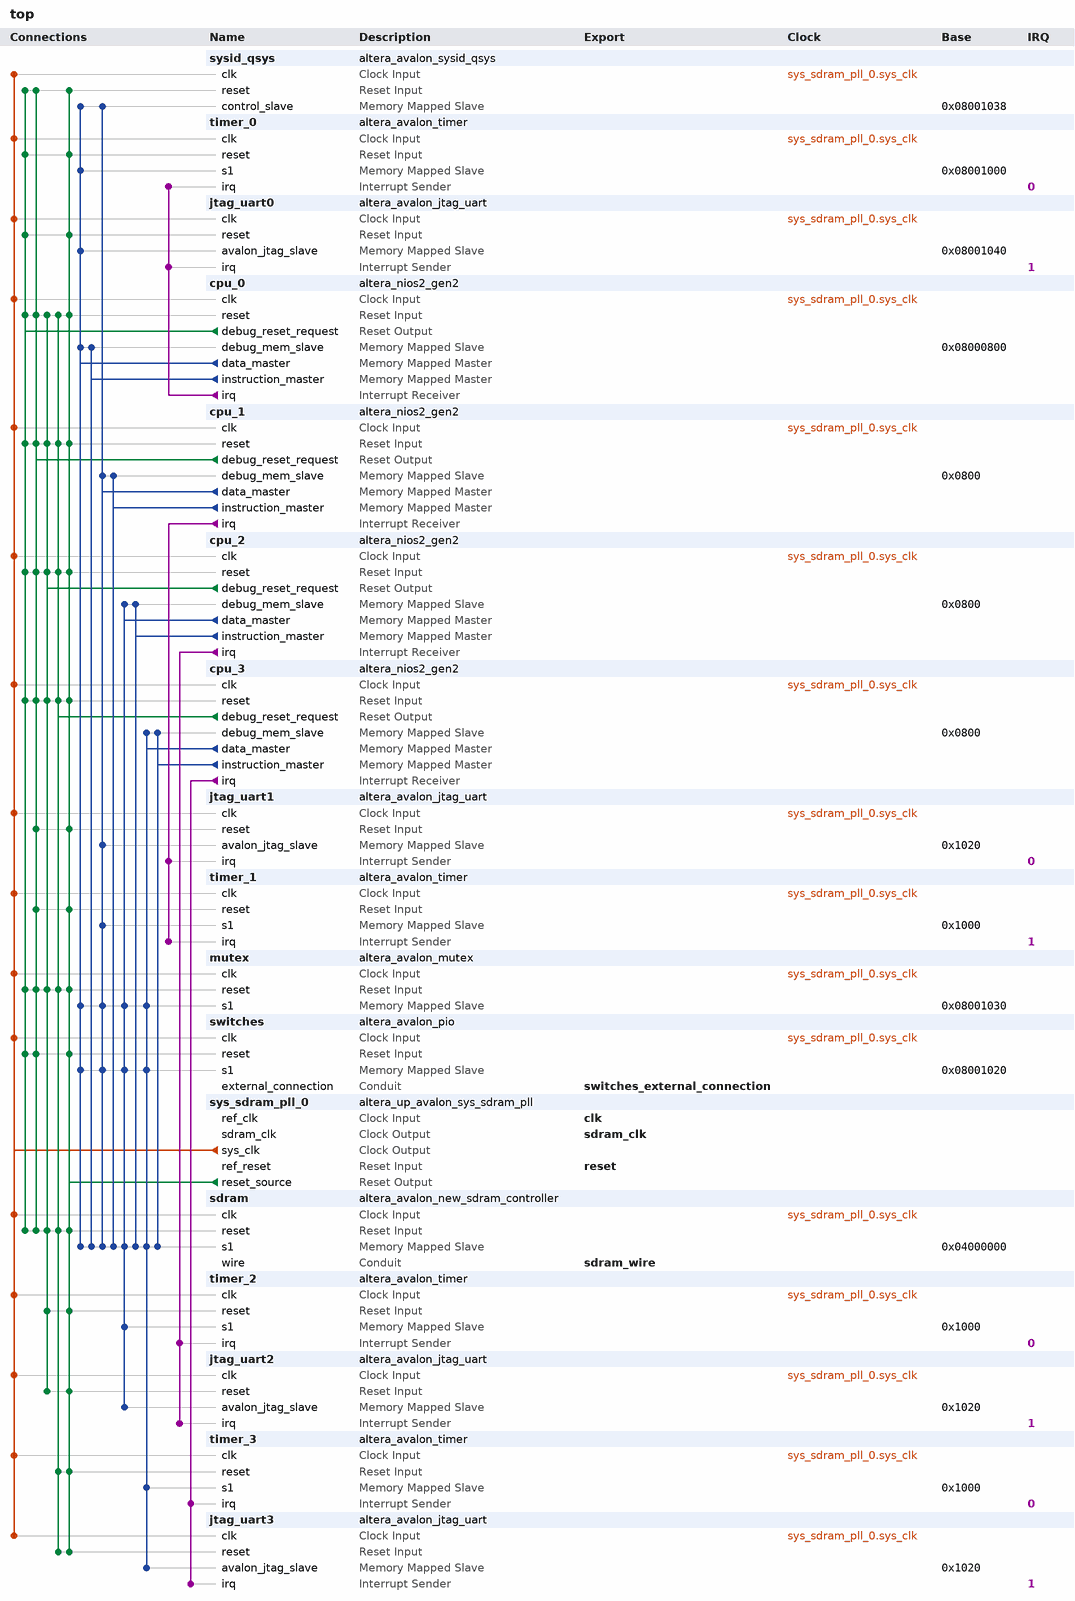
[diagram p0: system contents]
# Platform Designer (Qsys) system top, Cyclone IV E EP4CE115F29C7
# Parameters at their usual value, and those the tool derives, are not listed.
package require -exact qsys 18.1
create_system top
set_project_property DEVICE_FAMILY {Cyclone IV E}
set_project_property DEVICE EP4CE115F29C7

add_instance sysid_qsys altera_avalon_sysid_qsys 18.1
set_instance_parameter_value sysid_qsys id 0

add_instance timer_0 altera_avalon_timer 18.1
set_instance_parameter_value timer_0 period 10
set_instance_parameter_value timer_0 periodUnits MSEC

add_instance jtag_uart0 altera_avalon_jtag_uart 18.1
set_instance_parameter_value jtag_uart0 simInteractiveOptions NO_INTERACTIVE_WINDOWS

add_instance cpu_0 altera_nios2_gen2 18.1
set_instance_parameter_value cpu_0 cpuID 1
set_instance_parameter_value cpu_0 dcache_size 32768
set_instance_parameter_value cpu_0 exceptionSlave sdram.s1
set_instance_parameter_value cpu_0 icache_size 32768
set_instance_parameter_value cpu_0 impl Fast
set_instance_parameter_value cpu_0 resetSlave sdram.s1
set_instance_parameter_value cpu_0 setting_activateTrace true

add_instance cpu_1 altera_nios2_gen2 18.1
set_instance_parameter_value cpu_1 cpuID 2
set_instance_parameter_value cpu_1 dcache_size 2048
set_instance_parameter_value cpu_1 exceptionOffset 16777248
set_instance_parameter_value cpu_1 exceptionSlave sdram.s1
set_instance_parameter_value cpu_1 icache_size 4096
set_instance_parameter_value cpu_1 impl Fast
set_instance_parameter_value cpu_1 resetOffset 16777216
set_instance_parameter_value cpu_1 resetSlave sdram.s1

add_instance cpu_2 altera_nios2_gen2 18.1
set_instance_parameter_value cpu_2 cpuID 3
set_instance_parameter_value cpu_2 dcache_size 2048
set_instance_parameter_value cpu_2 exceptionOffset 33554464
set_instance_parameter_value cpu_2 exceptionSlave sdram.s1
set_instance_parameter_value cpu_2 icache_size 4096
set_instance_parameter_value cpu_2 impl Fast
set_instance_parameter_value cpu_2 resetOffset 33554432
set_instance_parameter_value cpu_2 resetSlave sdram.s1

add_instance cpu_3 altera_nios2_gen2 18.1
set_instance_parameter_value cpu_3 cpuID 4
set_instance_parameter_value cpu_3 dcache_size 2048
set_instance_parameter_value cpu_3 exceptionOffset 50331680
set_instance_parameter_value cpu_3 exceptionSlave sdram.s1
set_instance_parameter_value cpu_3 icache_size 4096
set_instance_parameter_value cpu_3 impl Fast
set_instance_parameter_value cpu_3 resetOffset 50331648
set_instance_parameter_value cpu_3 resetSlave sdram.s1

add_instance jtag_uart1 altera_avalon_jtag_uart 18.1
set_instance_parameter_value jtag_uart1 simInteractiveOptions NO_INTERACTIVE_WINDOWS

add_instance timer_1 altera_avalon_timer 18.1
set_instance_parameter_value timer_1 period 10
set_instance_parameter_value timer_1 periodUnits MSEC

add_instance mutex altera_avalon_mutex 18.1

add_instance switches altera_avalon_pio 18.1
set_instance_parameter_value switches direction Input
set_instance_parameter_value switches width 8

add_instance sys_sdram_pll_0 altera_up_avalon_sys_sdram_pll 18.0
set_instance_parameter_value sys_sdram_pll_0 CV_boards DE10-Standard
set_instance_parameter_value sys_sdram_pll_0 gui_outclk 50.0
set_instance_parameter_value sys_sdram_pll_0 gui_refclk 50.0

add_instance sdram altera_avalon_new_sdram_controller 18.1
set_instance_parameter_value sdram TAC 5.5
set_instance_parameter_value sdram TRCD 20.0
set_instance_parameter_value sdram TRP 20.0
set_instance_parameter_value sdram casLatency 3
set_instance_parameter_value sdram columnWidth 9
set_instance_parameter_value sdram dataWidth 32
set_instance_parameter_value sdram generateSimulationModel false
set_instance_parameter_value sdram model single_Micron_MT48LC4M32B2_7_chip
set_instance_parameter_value sdram numberOfBanks 4
set_instance_parameter_value sdram numberOfChipSelects 1
set_instance_parameter_value sdram powerUpDelay 100.0
set_instance_parameter_value sdram refreshPeriod 15.625
set_instance_parameter_value sdram rowWidth 13

add_instance timer_2 altera_avalon_timer 18.1
set_instance_parameter_value timer_2 period 10
set_instance_parameter_value timer_2 periodUnits MSEC

add_instance jtag_uart2 altera_avalon_jtag_uart 18.1
set_instance_parameter_value jtag_uart2 simInteractiveOptions NO_INTERACTIVE_WINDOWS

add_instance timer_3 altera_avalon_timer 18.1
set_instance_parameter_value timer_3 period 10
set_instance_parameter_value timer_3 periodUnits MSEC

add_instance jtag_uart3 altera_avalon_jtag_uart 18.1
set_instance_parameter_value jtag_uart3 simInteractiveOptions NO_INTERACTIVE_WINDOWS

# connections
add_connection sys_sdram_pll_0.sys_clk cpu_0.clk clock
add_connection sys_sdram_pll_0.sys_clk cpu_1.clk clock
add_connection sys_sdram_pll_0.sys_clk cpu_2.clk clock
add_connection sys_sdram_pll_0.sys_clk cpu_3.clk clock
add_connection sys_sdram_pll_0.sys_clk jtag_uart0.clk clock
add_connection sys_sdram_pll_0.sys_clk jtag_uart1.clk clock
add_connection sys_sdram_pll_0.sys_clk jtag_uart2.clk clock
add_connection sys_sdram_pll_0.sys_clk jtag_uart3.clk clock
add_connection sys_sdram_pll_0.sys_clk mutex.clk clock
add_connection sys_sdram_pll_0.sys_clk sdram.clk clock
add_connection sys_sdram_pll_0.sys_clk switches.clk clock
add_connection sys_sdram_pll_0.sys_clk sysid_qsys.clk clock
add_connection sys_sdram_pll_0.sys_clk timer_0.clk clock
add_connection sys_sdram_pll_0.sys_clk timer_1.clk clock
add_connection sys_sdram_pll_0.sys_clk timer_2.clk clock
add_connection sys_sdram_pll_0.sys_clk timer_3.clk clock
add_connection cpu_0.debug_reset_request cpu_0.reset reset
add_connection cpu_0.debug_reset_request cpu_1.reset reset
add_connection cpu_0.debug_reset_request cpu_2.reset reset
add_connection cpu_0.debug_reset_request cpu_3.reset reset
add_connection cpu_0.debug_reset_request jtag_uart0.reset reset
add_connection cpu_0.debug_reset_request mutex.reset reset
add_connection cpu_0.debug_reset_request sdram.reset reset
add_connection cpu_0.debug_reset_request switches.reset reset
add_connection cpu_0.debug_reset_request sysid_qsys.reset reset
add_connection cpu_0.debug_reset_request timer_0.reset reset
add_connection cpu_1.debug_reset_request cpu_0.reset reset
add_connection cpu_1.debug_reset_request cpu_1.reset reset
add_connection cpu_1.debug_reset_request cpu_2.reset reset
add_connection cpu_1.debug_reset_request cpu_3.reset reset
add_connection cpu_1.debug_reset_request jtag_uart1.reset reset
add_connection cpu_1.debug_reset_request mutex.reset reset
add_connection cpu_1.debug_reset_request sdram.reset reset
add_connection cpu_1.debug_reset_request switches.reset reset
add_connection cpu_1.debug_reset_request sysid_qsys.reset reset
add_connection cpu_1.debug_reset_request timer_1.reset reset
add_connection cpu_2.debug_reset_request cpu_0.reset reset
add_connection cpu_2.debug_reset_request cpu_1.reset reset
add_connection cpu_2.debug_reset_request cpu_2.reset reset
add_connection cpu_2.debug_reset_request cpu_3.reset reset
add_connection cpu_2.debug_reset_request jtag_uart2.reset reset
add_connection cpu_2.debug_reset_request mutex.reset reset
add_connection cpu_2.debug_reset_request sdram.reset reset
add_connection cpu_2.debug_reset_request timer_2.reset reset
add_connection cpu_3.debug_reset_request cpu_0.reset reset
add_connection cpu_3.debug_reset_request cpu_1.reset reset
add_connection cpu_3.debug_reset_request cpu_2.reset reset
add_connection cpu_3.debug_reset_request cpu_3.reset reset
add_connection cpu_3.debug_reset_request jtag_uart3.reset reset
add_connection cpu_3.debug_reset_request mutex.reset reset
add_connection cpu_3.debug_reset_request sdram.reset reset
add_connection cpu_3.debug_reset_request timer_3.reset reset
add_connection sys_sdram_pll_0.reset_source cpu_0.reset reset
add_connection sys_sdram_pll_0.reset_source cpu_1.reset reset
add_connection sys_sdram_pll_0.reset_source cpu_2.reset reset
add_connection sys_sdram_pll_0.reset_source cpu_3.reset reset
add_connection sys_sdram_pll_0.reset_source jtag_uart0.reset reset
add_connection sys_sdram_pll_0.reset_source jtag_uart1.reset reset
add_connection sys_sdram_pll_0.reset_source jtag_uart2.reset reset
add_connection sys_sdram_pll_0.reset_source jtag_uart3.reset reset
add_connection sys_sdram_pll_0.reset_source mutex.reset reset
add_connection sys_sdram_pll_0.reset_source sdram.reset reset
add_connection sys_sdram_pll_0.reset_source switches.reset reset
add_connection sys_sdram_pll_0.reset_source sysid_qsys.reset reset
add_connection sys_sdram_pll_0.reset_source timer_0.reset reset
add_connection sys_sdram_pll_0.reset_source timer_1.reset reset
add_connection sys_sdram_pll_0.reset_source timer_2.reset reset
add_connection sys_sdram_pll_0.reset_source timer_3.reset reset
add_connection cpu_0.data_master cpu_0.debug_mem_slave avalon
set_connection_parameter_value cpu_0.data_master/cpu_0.debug_mem_slave baseAddress 0x08000800
add_connection cpu_0.data_master jtag_uart0.avalon_jtag_slave avalon
set_connection_parameter_value cpu_0.data_master/jtag_uart0.avalon_jtag_slave baseAddress 0x08001040
add_connection cpu_0.data_master mutex.s1 avalon
set_connection_parameter_value cpu_0.data_master/mutex.s1 baseAddress 0x08001030
add_connection cpu_0.data_master sdram.s1 avalon
set_connection_parameter_value cpu_0.data_master/sdram.s1 baseAddress 0x04000000
add_connection cpu_0.data_master switches.s1 avalon
set_connection_parameter_value cpu_0.data_master/switches.s1 baseAddress 0x08001020
add_connection cpu_0.data_master sysid_qsys.control_slave avalon
set_connection_parameter_value cpu_0.data_master/sysid_qsys.control_slave baseAddress 0x08001038
add_connection cpu_0.data_master timer_0.s1 avalon
set_connection_parameter_value cpu_0.data_master/timer_0.s1 baseAddress 0x08001000
add_connection cpu_0.instruction_master cpu_0.debug_mem_slave avalon
set_connection_parameter_value cpu_0.instruction_master/cpu_0.debug_mem_slave baseAddress 0x08000800
add_connection cpu_0.instruction_master sdram.s1 avalon
set_connection_parameter_value cpu_0.instruction_master/sdram.s1 baseAddress 0x04000000
add_connection cpu_1.data_master cpu_1.debug_mem_slave avalon
set_connection_parameter_value cpu_1.data_master/cpu_1.debug_mem_slave baseAddress 0x0800
add_connection cpu_1.data_master jtag_uart1.avalon_jtag_slave avalon
set_connection_parameter_value cpu_1.data_master/jtag_uart1.avalon_jtag_slave baseAddress 0x1020
add_connection cpu_1.data_master mutex.s1 avalon
set_connection_parameter_value cpu_1.data_master/mutex.s1 baseAddress 0x08001030
add_connection cpu_1.data_master sdram.s1 avalon
set_connection_parameter_value cpu_1.data_master/sdram.s1 baseAddress 0x04000000
add_connection cpu_1.data_master switches.s1 avalon
set_connection_parameter_value cpu_1.data_master/switches.s1 baseAddress 0x08001020
add_connection cpu_1.data_master sysid_qsys.control_slave avalon
set_connection_parameter_value cpu_1.data_master/sysid_qsys.control_slave baseAddress 0x08001038
add_connection cpu_1.data_master timer_1.s1 avalon
set_connection_parameter_value cpu_1.data_master/timer_1.s1 baseAddress 0x1000
add_connection cpu_1.instruction_master cpu_1.debug_mem_slave avalon
set_connection_parameter_value cpu_1.instruction_master/cpu_1.debug_mem_slave baseAddress 0x0800
add_connection cpu_1.instruction_master sdram.s1 avalon
set_connection_parameter_value cpu_1.instruction_master/sdram.s1 baseAddress 0x04000000
add_connection cpu_2.data_master cpu_2.debug_mem_slave avalon
set_connection_parameter_value cpu_2.data_master/cpu_2.debug_mem_slave baseAddress 0x0800
add_connection cpu_2.data_master jtag_uart2.avalon_jtag_slave avalon
set_connection_parameter_value cpu_2.data_master/jtag_uart2.avalon_jtag_slave baseAddress 0x1020
add_connection cpu_2.data_master mutex.s1 avalon
set_connection_parameter_value cpu_2.data_master/mutex.s1 baseAddress 0x08001030
add_connection cpu_2.data_master sdram.s1 avalon
set_connection_parameter_value cpu_2.data_master/sdram.s1 baseAddress 0x04000000
add_connection cpu_2.data_master switches.s1 avalon
set_connection_parameter_value cpu_2.data_master/switches.s1 baseAddress 0x08001020
add_connection cpu_2.data_master timer_2.s1 avalon
set_connection_parameter_value cpu_2.data_master/timer_2.s1 baseAddress 0x1000
add_connection cpu_2.instruction_master cpu_2.debug_mem_slave avalon
set_connection_parameter_value cpu_2.instruction_master/cpu_2.debug_mem_slave baseAddress 0x0800
add_connection cpu_2.instruction_master sdram.s1 avalon
set_connection_parameter_value cpu_2.instruction_master/sdram.s1 baseAddress 0x04000000
add_connection cpu_3.data_master cpu_3.debug_mem_slave avalon
set_connection_parameter_value cpu_3.data_master/cpu_3.debug_mem_slave baseAddress 0x0800
add_connection cpu_3.data_master jtag_uart3.avalon_jtag_slave avalon
set_connection_parameter_value cpu_3.data_master/jtag_uart3.avalon_jtag_slave baseAddress 0x1020
add_connection cpu_3.data_master mutex.s1 avalon
set_connection_parameter_value cpu_3.data_master/mutex.s1 baseAddress 0x08001030
add_connection cpu_3.data_master sdram.s1 avalon
set_connection_parameter_value cpu_3.data_master/sdram.s1 baseAddress 0x04000000
add_connection cpu_3.data_master switches.s1 avalon
set_connection_parameter_value cpu_3.data_master/switches.s1 baseAddress 0x08001020
add_connection cpu_3.data_master timer_3.s1 avalon
set_connection_parameter_value cpu_3.data_master/timer_3.s1 baseAddress 0x1000
add_connection cpu_3.instruction_master cpu_3.debug_mem_slave avalon
set_connection_parameter_value cpu_3.instruction_master/cpu_3.debug_mem_slave baseAddress 0x0800
add_connection cpu_3.instruction_master sdram.s1 avalon
set_connection_parameter_value cpu_3.instruction_master/sdram.s1 baseAddress 0x04000000
add_connection cpu_0.irq jtag_uart0.irq interrupt
set_connection_parameter_value cpu_0.irq/jtag_uart0.irq irqNumber 1
add_connection cpu_0.irq timer_0.irq interrupt
set_connection_parameter_value cpu_0.irq/timer_0.irq irqNumber 0
add_connection cpu_1.irq jtag_uart1.irq interrupt
set_connection_parameter_value cpu_1.irq/jtag_uart1.irq irqNumber 0
add_connection cpu_1.irq timer_1.irq interrupt
set_connection_parameter_value cpu_1.irq/timer_1.irq irqNumber 1
add_connection cpu_2.irq jtag_uart2.irq interrupt
set_connection_parameter_value cpu_2.irq/jtag_uart2.irq irqNumber 1
add_connection cpu_2.irq timer_2.irq interrupt
set_connection_parameter_value cpu_2.irq/timer_2.irq irqNumber 0
add_connection cpu_3.irq jtag_uart3.irq interrupt
set_connection_parameter_value cpu_3.irq/jtag_uart3.irq irqNumber 1
add_connection cpu_3.irq timer_3.irq interrupt
set_connection_parameter_value cpu_3.irq/timer_3.irq irqNumber 0

# exported interfaces
add_interface clk clock sink
set_interface_property clk EXPORT_OF sys_sdram_pll_0.ref_clk
add_interface reset reset sink
set_interface_property reset EXPORT_OF sys_sdram_pll_0.ref_reset
add_interface sdram_clk clock source
set_interface_property sdram_clk EXPORT_OF sys_sdram_pll_0.sdram_clk
add_interface sdram_wire conduit end
set_interface_property sdram_wire EXPORT_OF sdram.wire
add_interface switches_external_connection conduit end
set_interface_property switches_external_connection EXPORT_OF switches.external_connection

set_interconnect_requirement {$system} qsys_mm.clockCrossingAdapter HANDSHAKE
set_interconnect_requirement {$system} qsys_mm.enableEccProtection FALSE
set_interconnect_requirement {$system} qsys_mm.insertDefaultSlave FALSE
set_interconnect_requirement {$system} qsys_mm.maxAdditionalLatency 0

save_system top.qsys
